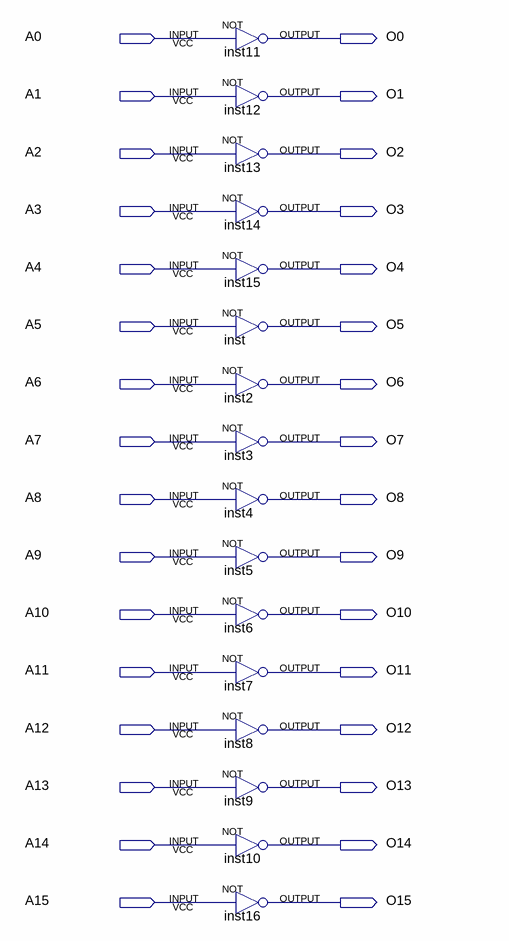
[diagram p0: schematic sheet]
// Quartus schematic Not_16bit.bdf as structural Verilog: 16 symbols, 32 pins
module Not_16bit (
  input  A0,
  input  A1,
  input  A2,
  input  A3,
  input  A4,
  input  A5,
  input  A6,
  input  A7,
  input  A8,
  input  A9,
  input  A10,
  input  A11,
  input  A12,
  input  A13,
  input  A14,
  input  A15,
  output O0,
  output O1,
  output O2,
  output O3,
  output O4,
  output O5,
  output O6,
  output O7,
  output O8,
  output O9,
  output O10,
  output O11,
  output O12,
  output O13,
  output O14,
  output O15
);

  not inst11 (O0, A0);
  not inst12 (O1, A1);
  not inst13 (O2, A2);
  not inst14 (O3, A3);
  not inst15 (O4, A4);
  not inst (O5, A5);
  not inst2 (O6, A6);
  not inst3 (O7, A7);
  not inst4 (O8, A8);
  not inst5 (O9, A9);
  not inst6 (O10, A10);
  not inst7 (O11, A11);
  not inst8 (O12, A12);
  not inst9 (O13, A13);
  not inst10 (O14, A14);
  not inst16 (O15, A15);
endmodule
